# Altium schematic sheet Sheet.SchDoc
size A4
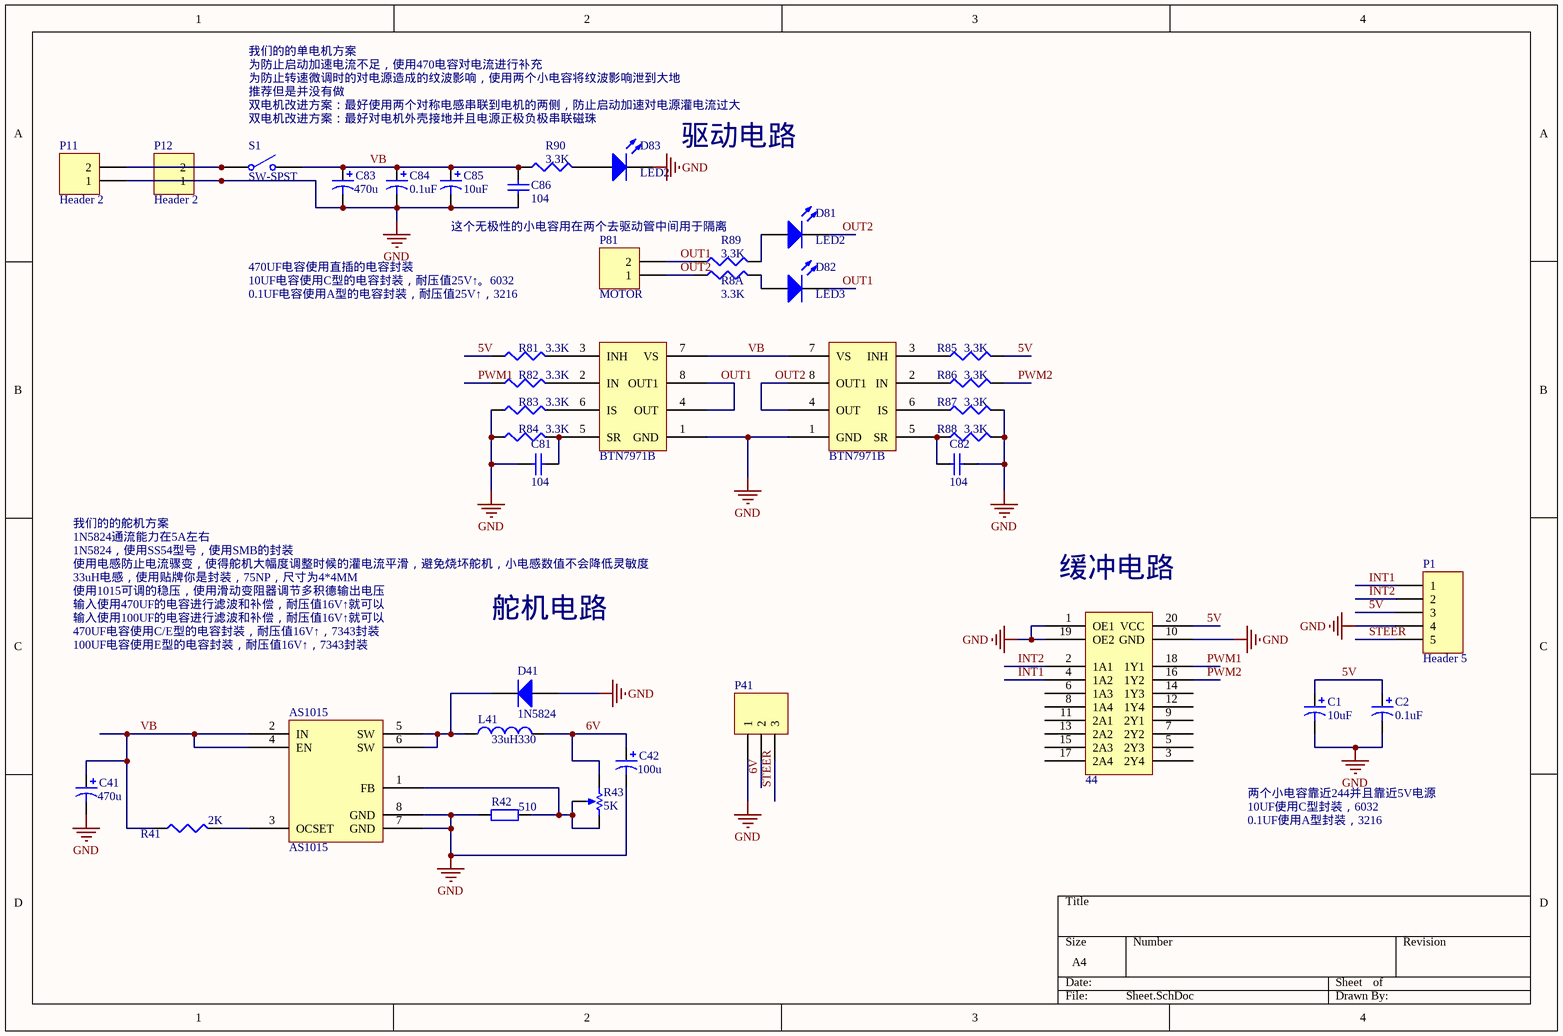
[diagram p0: Sheet.SchDoc]

## Parts
1B-1  BTN7971B  [BTN7971B]
1B-2  BTN7971B  [BTN7971B]
AS1015  AS1015  [SOP-8N]
C1  value 10uF  [C6032]  (hidden comment: Cap Pol3)
C2  value 0.1uF  [C3216]  (hidden comment: Cap Pol3)
C41  value 470u  [C7343]  (hidden comment: Cap Pol3)
C42  value 100u  [C6032]  (hidden comment: Cap Pol3)
C81  value 104  [C0805]  (hidden comment: Cap Chip 0805)
C82  value 104  [C0805]  (hidden comment: Cap Chip 0805)
C83  value 470u  [CAPPR5-8X11.5]  (hidden comment: Cap Pol3)
C84  value 0.1uF  [C3216]  (hidden comment: Cap Pol3)
C85  value 10uF  [C6032]  (hidden comment: Cap Pol3)
C86  value 104  [C0805]  (hidden comment: Cap Chip 0805)
D41  1N5824  [SMB]
D81  LED2  [SOD-123]
D82  LED3  [SOD-123]
D83  LED2  [C1206]
L41  value 33uH330  [CD75NP]  (hidden comment: Inductor)
P1  Header 5  [HDR1X5]
P11  Header 2  [2PIN-5.08A]
P12  Header 2  [T_Plug]
P41  Header 3  [HDR1X3]  (value not drawn)
P81  MOTOR  [5.08-2P]
R8A  value 3.3K  [R0805]
R41  value 2K  [R0805]  (hidden comment: Res3)
R42  value 510  [R0805]  (hidden comment: Res2)
R43  value 5K  [VR_B1]  (hidden comment: RPot)
R81  value 3.3K  [R0805]
R82  value 3.3K  [R0805]
R83  value 3.3K  [R0805]
R84  value 3.3K  [R0805]
R85  value 3.3K  [R0805]
R86  value 3.3K  [R0805]
R87  value 3.3K  [R0805]
R88  value 3.3K  [R0805]
R89  value 3.3K  [R0805]
R90  value 3.3K  [R0805]
S1  SW-SPST  [SW-TO3]
Z  44  [SOP20_M]

## Nets
GND: 1B-1.1(GND) 1B-2.1(GND) AS1015.7(GND) AS1015.8(GND) C1.2 C2.2 C41.2 C42.2 C81.1 C82.2 C83.2 C84.2 C85.2 C86.1 D41.1(A) D83.2(K) P1.4 P11.1 P12.1 P41.1 R42.1 R83.1 R84.1 R87.2 R88.2 Z.1(OE1) Z.10(GND) Z.19(OE2)
5V: C1.1 C2.1 P1.3 R81.1 R85.2 Z.20(VCC)
6V: C42.1 L41.2 P41.2 R43.1(TOP)
INT1: P1.1 Z.4(1A2)
INT2: P1.2 Z.2(1A1)
OUT1: 1B-1.4(OUT) 1B-1.8(OUT1) D82.2(K) P81.2 R89.1
OUT2: 1B-2.4(OUT) 1B-2.8(OUT1) D81.2(K) P81.1 R8A.1
PWM1: R82.1 Z.18(1Y1)
PWM2: R86.2 Z.16(1Y2)
STEER: P1.5 P41.3
VB: 1B-1.7(VS) 1B-2.7(VS) AS1015.2(IN) AS1015.4(EN) C41.1 C83.1 C84.1 C85.1 C86.2 R41.1 R90.1 S1.2(NO)
Net1B-1_2: 1B-1.2(IN) R82.2
Net1B-1_3: 1B-1.3(INH) R81.2
Net1B-1_5: 1B-1.5(SR) C81.2 R84.2
Net1B-1_6: 1B-1.6(IS) R83.2
Net1B-2_2: 1B-2.2(IN) R86.1
Net1B-2_3: 1B-2.3(INH) R85.1
Net1B-2_5: 1B-2.5(SR) C82.1 R88.1
Net1B-2_6: 1B-2.6(IS) R87.1
NetAS1015_1: AS1015.1(FB) R42.2 R43.2(TAP) R43.3(BOT)
NetAS1015_3: AS1015.3(OCSET) R41.2
NetAS1015_5: AS1015.5(SW) AS1015.6(SW) D41.2(K) L41.1
NetD81_1: D81.1(A) R89.2
NetD82_1: D82.1(A) R8A.2
NetD83_1: D83.1(A) R90.2
NetP11_2: P11.2 P12.2 S1.1(COMMON)

Not connected (* = marked no-connect by the designer): Z 3(2Y4) 5(2Y3) 6(1A3) 7(2Y2) 8(1A4) 9(2Y1) 11(2A1) 12(1Y4) 13(2A2) 14(1Y3) 15(2A3) 17(2A4)

## Notes on the sheet
- 为防止启动加速电流不足，使用470电容对电流进行补充
- 为防止转速微调时的对电源造成的纹波影响，使用两个小电容将纹波影响泄到大地
- 双电机改进方案：最好使用两个对称电感串联到电机的两侧，防止启动加速对电源灌电流过大
- 我们的的单电机方案
- 推荐但是并没有做
- 双电机改进方案：最好对电机外壳接地并且电源正极负极串联磁珠
- 驱动电路
- 这个无极性的小电容用在两个去驱动管中间用于隔离
- 470UF电容使用直插的电容封装
- 10UF电容使用C型的电容封装，耐压值25V↑。6032
- 0.1UF电容使用A型的电容封装，耐压值25V↑，3216
- 我们的的舵机方案
- 1N5824通流能力在5A左右
- 使用电感防止电流骤变，使得舵机大幅度调整时候的灌电流平滑，避免烧坏舵机，小电感数值不会降低灵敏度
- 33uH电感，使用贴牌你是封装，75NP，尺寸为4*4MM
- 1N5824，使用SS54型号，使用SMB的封装
- (near Z) 缓冲电路
- 使用1015可调的稳压，使用滑动变阻器调节多积德输出电压
- 输入使用470UF的电容进行滤波和补偿，耐压值16V↑就可以
- 输入使用100UF的电容进行滤波和补偿，耐压值16V↑就可以
- 470UF电容使用C/E型的电容封装，耐压值16V↑，7343封装
- 100UF电容使用E型的电容封装，耐压值16V↑，7343封装
- 舵机电路
- 两个小电容靠近244并且靠近5V电源
- 10UF使用C型封装，6032
- 0.1UF使用A型封装，3216

## Library data of the parts
1B-1 = BTN9791B: TO-263
C1 C2 C41 C42 C83-C85 = Cap Pol3: Polarized Capacitor (Surface Mount); Published: 8-Jun-2000; LatestRevisionDate: 29-May-2009; LatestRevisionNote: IPC-7351 Footprint Added.; PackageReference: C0805; Publisher: Altium Limited; PackageDescription: Chip Capacitor
C81 C82 C86 = Cap Chip 0805: Polarized Capacitor (Radial); Published: 8-Jun-2000; Revision: July-2002: Re-released for DXP Platform.; Publisher: Altium Limited
D41 = 1N4007: 1.0 Ampere General Purpose Rectifier; Published: 8-Jun-2000; LatestRevisionDate: 17-Jul-2002; LatestRevisionNote: Re-released for DXP Platform.; DatasheetDocument: 1998; PackageDocument: Aug-1999; PackageReference: DO-41; Publisher: Altium Limited; Code_JEDEC: DO-204-AL; ComponentLink1Description: Manufacturer Link; ComponentLink1URL: http://www.fairchildsemi.com/; ComponentLink2Description: Pinout Specification; ComponentLink2URL: http://www.fairchildsemi.com/ds/1N%2F1N4001.pdf
D81-D83 = LED3: Typical BLUE SiC LED; Published: 8-Jun-2000; LatestRevisionDate: 17-Dec-2003; LatestRevisionNote: PCB Footprint replaced.; DatasheetVersion: 16-Apr-2002; PackageVersion: 16-Apr-2002; PackageReference: 3.5X2.8X1.9; Publisher: Altium Limited; PackageDescription: SM LED; 2 C-Bend Leads; Body 3.5 x 2.8 x 1.9 mm, inc leads (LxWxH typ)
L41 = Inductor: Code_IEC: 1005; Published: 8-Jun-2000; LatestRevisionDate: 29-May-2009; LatestRevisionNote: IPC-7351 Footprint Added.; PackageReference: 0402-A; Publisher: Altium Limited; PackageDescription: Chip Inductor; Code_JEITA: 0402
P1 = Header 5: Header, 5-Pin; LatestRevisionDate: 17-Jul-2002; LatestRevisionNote: Re-released for DXP Platform.; Publisher: Altium Limited
P11 P12 P81 = Header 2: Header, 2-Pin; LatestRevisionDate: 17-Jul-2002; LatestRevisionNote: Re-released for DXP Platform.; Publisher: Altium Limited
P41 = Header 3: Header, 3-Pin; LatestRevisionDate: 17-Jul-2002; LatestRevisionNote: Re-released for DXP Platform.; Publisher: Altium Limited
R8A R41 R81-R90 = Res3: Resistor; Published: 8-Jun-2000; LatestRevisionDate: 29-May-2009; LatestRevisionNote: IPC-7351 Footprint Added.; PackageReference: J1-0603; Publisher: Altium Limited; PackageDescription: Chip Resistor
R42 = Res2: Resistor; Published: 8-Jun-2000; LatestRevisionDate: 17-Jul-2002; LatestRevisionNote: Re-released for DXP Platform.; PackageReference: AXIAL-0.4; Publisher: Altium Limited; PackageDescription: Axial Device, Thru-Hole; 2 Leads; 0.4 in Pin Spacing
R43 = RPot: 精密可调电阻; Sim Note: Enter the Resistance value and the set point into parameter fields.; Set Position: 0.5; Published: 8-Jun-2000; LatestRevisionDate: 17-Jul-2002; LatestRevisionNote: Re-released for DXP Platform.; PackageReference: VR5; Publisher: Altium Limited
S1 = SW-SPST: Single-Pole, Single-Throw Switch; Published: 24-Mar-1999; Revision: July-2002: Re-released for DXP Platform.; Publisher: Altium Limited
Z = 74LS244: SOP-20